# EAGLE design sequint (EAGLE 6.1)

## Sheet 1 of 4
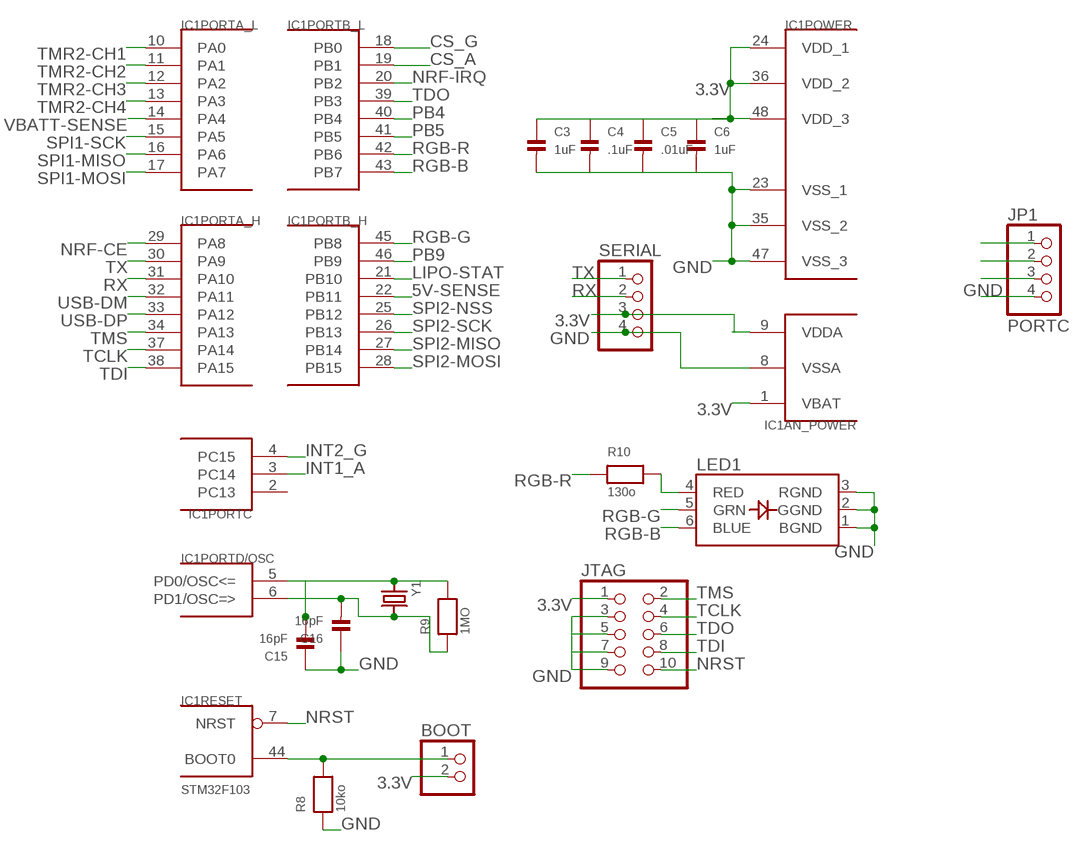
[diagram p0: schematic, sheet 1]

### Parts
BOOT  HEADER-1X2ROUND  [1X02_ROUND]
C3  1uF  CAP_CERAMIC0402  [0402]
C4  .1uF  CAP_CERAMIC0402  [0402]
C5  .01uF  CAP_CERAMIC0402  [0402]
C6  1uF  CAP_CERAMIC0402  [0402]
C15  16pF  CAP_CERAMIC0402  [0402]
C16  16pF  CAP_CERAMIC0402  [0402]
IC1  STM32F103  STM32F10XCXT6  [TQFP48]
JP1  PORTC  HEADER-1X4ROUND  [1X04_ROUND]
JTAG  HEADER-2X5  [2X05]
LED1  LED_RGB_PLCC6CREE-CLV6A  [RGBLED_PLCC6]
R8  10ko  RESISTOR0402  [0402]
R9  1MO  RESISTOR0402  [0402]
R10  130o  RESISTOR0402  [0402]
SERIAL  HEADER-1X4ROUND  [1X04_ROUND]
Y1  CRYSTALSMD  [HC49UP]

### Nets
3.3V: BOOT.2 C3.1 C4.1 C5.1 C6.1 IC1.1(AN_POWER:VBAT) IC1.9(AN_POWER:VDDA) IC1.24(POWER:VDD_1) IC1.36(POWER:VDD_2) IC1.48(POWER:VDD_3) JTAG.1 SERIAL.3 ; also sheet 2,3,4
5V-SENSE: IC1.22(PORTB_H:PB11) ; also sheet 3
BOOT0: BOOT.1 IC1.44(RESET:BOOT0) R8.2
CS_A: IC1.19(PORTB_L:PB1) ; also sheet 4
CS_G: IC1.18(PORTB_L:PB0) ; also sheet 4
GND: C3.2 C4.2 C5.2 C6.2 C15.1 C16.1 IC1.8(AN_POWER:VSSA) IC1.23(POWER:VSS_1) IC1.35(POWER:VSS_2) IC1.47(POWER:VSS_3) JP1.4 JTAG.3 JTAG.5 JTAG.7 JTAG.9 LED1.1(BGND) LED1.2(GGND) LED1.3(RGND) R8.1 SERIAL.4 ; also sheet 2,3,4
INT1_A: IC1.3(PORTC:PC14) ; also sheet 4
INT2_G: IC1.4(PORTC:PC15) ; also sheet 4
LIPO-STAT: IC1.21(PORTB_H:PB10) ; also sheet 3
NRF-CE: IC1.29(PORTA_H:PA8) ; also sheet 2
NRF-IRQ: IC1.20(PORTB_L:PB2) ; also sheet 2
NRST: IC1.7(RESET:NRST) JTAG.10
PB4: IC1.40(PORTB_L:PB4) JP1.1
PB5: IC1.41(PORTB_L:PB5) JP1.2
PB9: IC1.46(PORTB_H:PB9) JP1.3
PD0: C15.2 IC1.5(PORTD/OSC:PD0/OSC<=) R9.2 Y1.1
PD1: C16.2 IC1.6(PORTD/OSC:PD1/OSC=>) R9.1 Y1.2
RGB-B: IC1.43(PORTB_L:PB7) LED1.6(BLUE)
RGB-G: IC1.45(PORTB_H:PB8) LED1.5(GRN)
RGB-R: IC1.42(PORTB_L:PB6) R10.1
RGB-RP: LED1.4(RED) R10.2
RX: IC1.31(PORTA_H:PA10) SERIAL.2
SPI1-MISO: IC1.16(PORTA_L:PA6) ; also sheet 4
SPI1-MOSI: IC1.17(PORTA_L:PA7) ; also sheet 4
SPI1-SCK: IC1.15(PORTA_L:PA5) ; also sheet 4
SPI2-MISO: IC1.27(PORTB_H:PB14) ; also sheet 2
SPI2-MOSI: IC1.28(PORTB_H:PB15) ; also sheet 2
SPI2-NSS: IC1.25(PORTB_H:PB12) ; also sheet 2
SPI2-SCK: IC1.26(PORTB_H:PB13) ; also sheet 2
TCLK: IC1.37(PORTA_H:PA14) JTAG.4
TDI: IC1.38(PORTA_H:PA15) JTAG.8
TDO: IC1.39(PORTB_L:PB3) JTAG.6
TMR2-CH1: IC1.10(PORTA_L:PA0) ; also sheet 3
TMR2-CH2: IC1.11(PORTA_L:PA1) ; also sheet 3
TMR2-CH3: IC1.12(PORTA_L:PA2) ; also sheet 3
TMR2-CH4: IC1.13(PORTA_L:PA3) ; also sheet 3
TMS: IC1.34(PORTA_H:PA13) JTAG.2
TX: IC1.30(PORTA_H:PA9) SERIAL.1
USB-DM: IC1.32(PORTA_H:PA11) ; also sheet 3
USB-DP: IC1.33(PORTA_H:PA12) ; also sheet 3
VBATT-SENSE: IC1.14(PORTA_L:PA4) ; also sheet 3
Unconnected: IC1.2(PORTC:PC13)

## Sheet 2 of 4
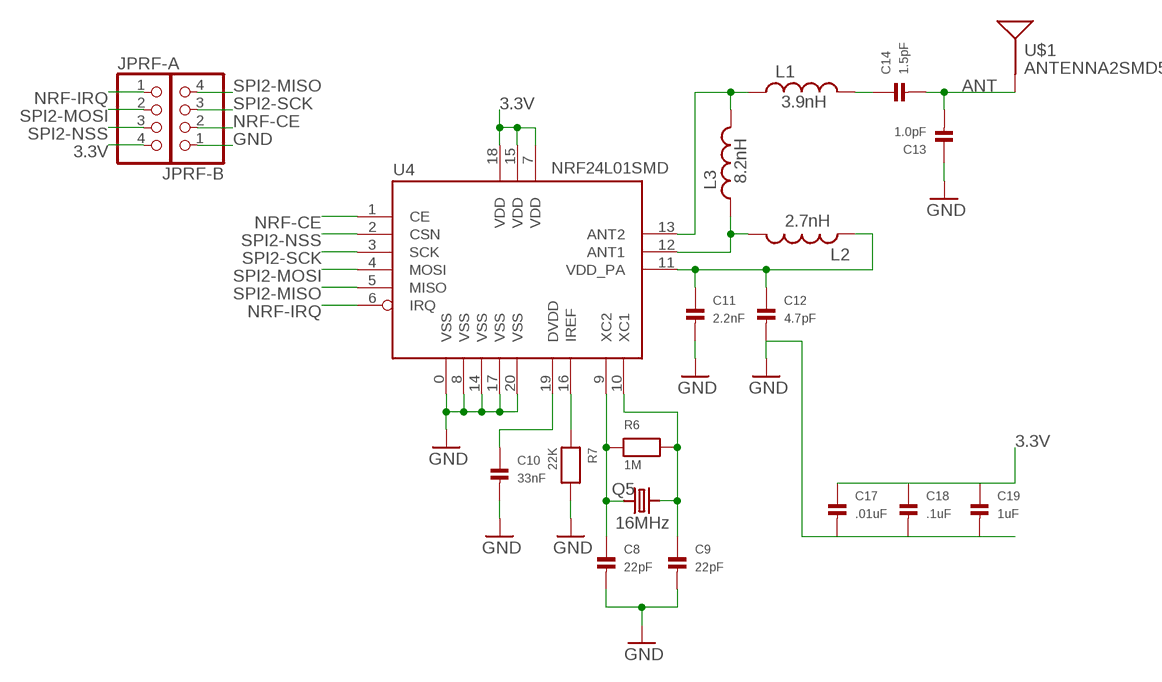
[diagram p1: schematic, sheet 2]

### Parts
C8  22pF  CAP_CERAMIC0402  [0402]
C9  22pF  CAP_CERAMIC0402  [0402]
C10  33nF  CAP_CERAMIC0402  [0402]
C11  2.2nF  CAP_CERAMIC0402  [0402]
C12  4.7pF  CAP_CERAMIC0402  [0402]
C13  1.0pF  CAP_CERAMIC0402  [0402]
C14  1.5pF  CAP_CERAMIC0402  [0402]
C17  .01uF  CAP_CERAMIC0402  [0402]
C18  .1uF  CAP_CERAMIC0402  [0402]
C19  1uF  CAP_CERAMIC0402  [0402]
JPRF-A  HEADER-1X4ROUND  [1X04_ROUND]
JPRF-B  HEADER-1X4ROUND  [1X04_ROUND]
L1  3.9nH  INDUCTOR0402  [C0402]
L2  2.7nH  INDUCTOR0402  [C0402]
L3  8.2nH  INDUCTOR0402  [C0402]
Q5  16MHz  CRYSTALSMD  [HC49UP]
R6  1M  RESISTOR0402  [0402]
R7  22K  RESISTOR0402  [0402]
U4  NRF24L01SMD  [QFN20]
U$1  ANTENNA2SMD5  [ANTENNA-CHIP5]

### Nets
3.3V: C17.1 C18.1 C19.1 JPRF-A.4 U4.7(VDD) U4.15(VDD) U4.18(VDD) ; also sheet 1,3,4
ANT: C13.2 C14.2 U$1.FEED(SIGNAL)
ANT1: L2.2 L3.1 U4.12(ANT1)
ANT2: L1.1 L3.2 U4.13(ANT2)
DVDD: C10.1 U4.19(DVDD)
GND: C8.2 C9.2 C10.2 C11.2 C12.2 C13.1 C17.2 C18.2 C19.2 JPRF-B.1 R7.2 U4.0(VSS) U4.8(VSS) U4.14(VSS) U4.17(VSS) U4.20(VSS) ; also sheet 1,3,4
N$2: C8.1 Q5.1 R6.1 U4.9(XC2)
N$3: C9.1 Q5.2 R6.2 U4.10(XC1)
N$5: R7.1 U4.16(IREF)
N$10: C14.1 L1.2
NRF-CE: JPRF-B.2 U4.1(CE) ; also sheet 1
NRF-IRQ: JPRF-A.1 U4.6(IRQ) ; also sheet 1
SPI2-MISO: JPRF-B.4 U4.5(MISO) ; also sheet 1
SPI2-MOSI: JPRF-A.2 U4.4(MOSI) ; also sheet 1
SPI2-NSS: JPRF-A.3 U4.2(CSN) ; also sheet 1
SPI2-SCK: JPRF-B.3 U4.3(SCK) ; also sheet 1
VDD_PA: C11.1 C12.1 L2.1 U4.11(VDD_PA)

## Sheet 3 of 4
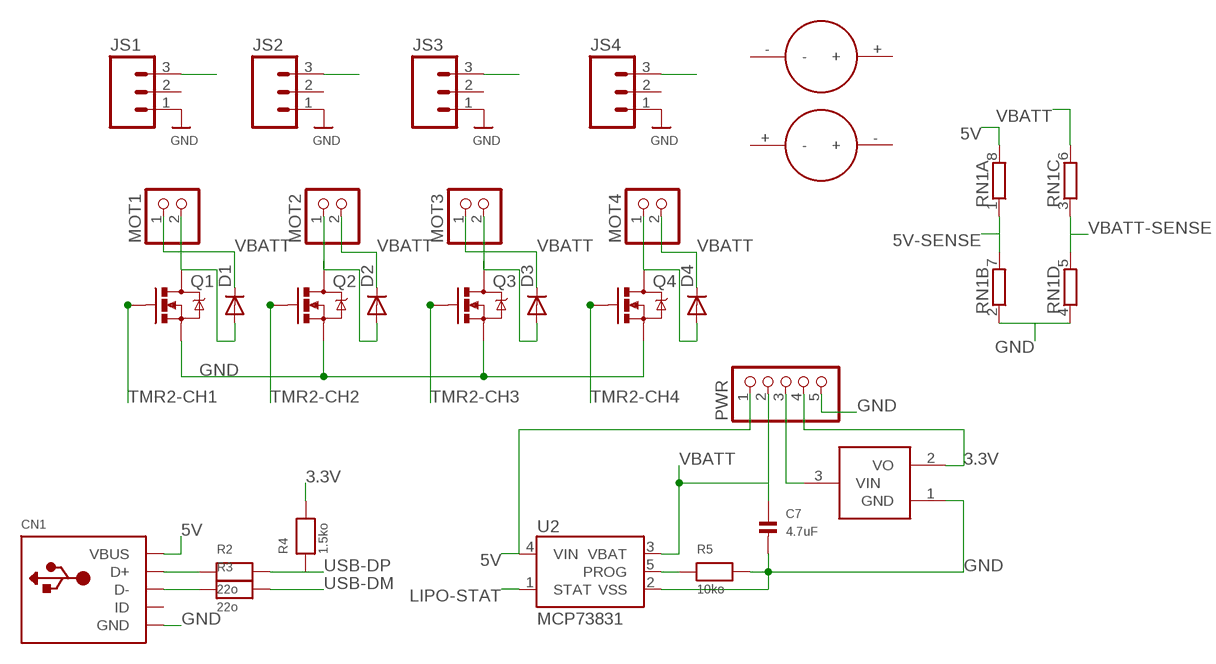
[diagram p2: schematic, sheet 3]

### Parts
3.3VREG  VREG  [SOT23-3]
C7  4.7uF  CAP_CERAMIC0603  [0603]
CN1  USBMINIB  [USB-MINIB]
D1  DIODESOD523  [SOD523]
D2  DIODESOD523  [SOD523]
D3  DIODESOD523  [SOD523]
D4  DIODESOD523  [SOD523]
JS1  M03LOCK  [1X03_LOCK]
JS2  M03LOCK  [1X03_LOCK]
JS3  M03LOCK  [1X03_LOCK]
JS4  M03LOCK  [1X03_LOCK]
MOT1  HEADER-1X2ROUND  [1X02_ROUND]
MOT2  HEADER-1X2ROUND  [1X02_ROUND]
MOT3  HEADER-1X2ROUND  [1X02_ROUND]
MOT4  HEADER-1X2ROUND  [1X02_ROUND]
PWR  HEADER-1X5ROUND  [1X05_ROUND]
Q1  MOSFET-N  MOSFET-NCHANNELSMD  [SOT23-3]
Q2  MOSFET-N  MOSFET-NCHANNELSMD  [SOT23-3]
Q3  MOSFET-N  MOSFET-NCHANNELSMD  [SOT23-3]
Q4  MOSFET-N  MOSFET-NCHANNELSMD  [SOT23-3]
R2  22o  RESISTOR0402  [0402]
R3  22o  RESISTOR0402  [0402]
R4  1.5ko  RESISTOR0402  [0402]
R5  10ko  RESISTOR0402  [0402]
RN1  RNETWORK  [RN8P-4R-CRA06S]
U2  MCP73831  [SOT23-5]
U$6  MOT_RICCW  [MOT_RIC_BM_CW]
U$7  MOT_RICCCW  [MOT_RIC_BM_CCW]

### Nets
3.3V: 3.3VREG.2(VO) PWR.4 R4.2 ; also sheet 1,2,4
5V: CN1.VBUS PWR.1 RN1.8 U2.4(VIN)
5V-SENSE: RN1.1 RN1.7 ; also sheet 1
GND: 3.3VREG.1(GND) C7.2 CN1.GND JS1.1 JS2.1 JS3.1 JS4.1 PWR.5 Q1.2(S) Q2.2(S) Q3.2(S) Q4.2(S) R5.2 RN1.2 RN1.4 U2.2(VSS) ; also sheet 1,2,4
LIPO-STAT: U2.1(STAT) ; also sheet 1
PROG: R5.1 U2.5(PROG)
TMR2-CH1: JS1.3 Q1.1(G) ; also sheet 1
TMR2-CH2: JS2.3 Q2.1(G) ; also sheet 1
TMR2-CH3: JS3.3 Q3.1(G) ; also sheet 1
TMR2-CH4: JS4.3 Q4.1(G) ; also sheet 1
USB+: CN1.D+ R2.1
USB-: CN1.D- R3.1
USB-DM: R3.2 ; also sheet 1
USB-DP: R2.2 R4.1 ; also sheet 1
VBATT: C7.1 D1.C D2.C D3.C D4.C MOT1.1 MOT2.2 MOT3.1 MOT4.2 PWR.2 RN1.6 U2.3(VBAT)
VBATT-SENSE: RN1.3 RN1.5 ; also sheet 1
VIN_3.3V: 3.3VREG.3(VIN) PWR.3
VL-1: D1.A MOT1.2 Q1.3(D)
VL-2: D2.A MOT2.1 Q2.3(D)
VL-3: D3.A MOT3.2 Q3.3(D)
VL-4: D4.A MOT4.1 Q4.3(D)
Unconnected: CN1.ID JS1.2 JS2.2 JS3.2 JS4.2 U$6.+ U$6.- U$7.+(-) U$7.-(+)

## Sheet 4 of 4
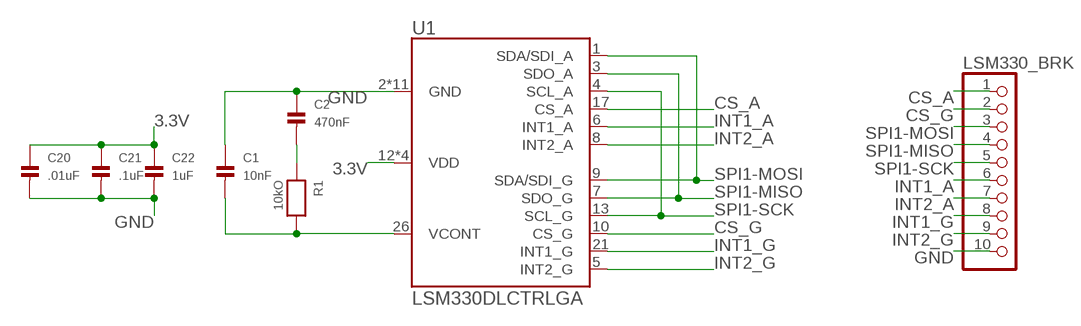
[diagram p3: schematic, sheet 4]

### Parts
C1  10nF  CAP_CERAMIC0402  [0402]
C2  470nF  CAP_CERAMIC0402  [0402]
C20  .01uF  CAP_CERAMIC0402  [0402]
C21  .1uF  CAP_CERAMIC0402  [0402]
C22  1uF  CAP_CERAMIC0402  [0402]
LSM330_BRK  HEADER-1X10ROUND  [1X10_ROUND]
R1  10kO  RESISTOR0402  [0402]
U1  LSM330DLCTRLGA  [LGA28L]

### Nets
3.3V: C20.1 C21.1 C22.1 U1.12(VDD) U1.15(VDD) U1.22(VDD) U1.28(VDD) ; also sheet 1,2,3
CS_A: LSM330_BRK.1 U1.17(CS_A) ; also sheet 1
CS_G: LSM330_BRK.2 U1.10(CS_G) ; also sheet 1
GND: C1.1 C2.1 C20.2 C21.2 C22.2 LSM330_BRK.10 U1.2(GND) U1.11(GND) U1.14(GND) U1.16(GND) U1.18(GND) U1.19(GND) U1.20(GND) U1.23(GND) U1.24(GND) U1.25(GND) U1.27(GND) ; also sheet 1,2,3
INT1_A: LSM330_BRK.6 U1.6(INT1_A) ; also sheet 1
INT1_G: LSM330_BRK.8 U1.21(INT1_G)
INT2_A: LSM330_BRK.7 U1.8(INT2_A)
INT2_G: LSM330_BRK.9 U1.5(INT2_G) ; also sheet 1
SPI1-MISO: LSM330_BRK.4 U1.3(SDO_A) U1.7(SDO_G) ; also sheet 1
SPI1-MOSI: LSM330_BRK.3 U1.1(SDA/SDI_A) U1.9(SDA/SDI_G) ; also sheet 1
SPI1-SCK: LSM330_BRK.5 U1.4(SCL_A) U1.13(SCL_G) ; also sheet 1
VCONT: C1.2 R1.2 U1.26(VCONT)
VCONT_1: C2.2 R1.1

## Library data of the parts
3.3VREG = nonolith:VREG
BOOT MOT1-MOT4 = nonolith:HEADER-1X2: PIN HEADER
C1-C22 = nonolith:CAP_CERAMIC: Ceramic Capacitors 0402 - 0402 Surface Mount Capacitors 0.1uF 10V 10% [Digikey: 490-1318-2-ND] 0603 - 0603 Surface Mount Capacitors 16 pF 50V 5% [Digikey: 445-5051-2-ND] 22 pF 50V [Digikey: PCC220ACVTR-ND] 33 pF 50V 5% [Digikey: 490-1415-1-ND] 56pF 50V 5% [Digikey: 490-1421-1-ND] 220pF 50V 5% [Digikey: 445-1285-1-ND] 680 pF 50V 2200 pF 50V 5% C0G [Digikey: 445-1297-1-ND] 5600 pF 100V 5% X7R [Digikey: 478-3711-1-ND] 0.1 µF 25V 10% [Digikey: PCC2277TR-ND] 0.22 µF 16V 10% X7R [Digikey: 445-1318-1-ND] 1.0 µF 25V 10% [Digikey: 445-5146-2-ND] 0603 - RF Specific 3pF 250V +/-0.1pF RF [Digikey: 712-1347-1-ND] 18 pF 250V 5% [Digikey: 478-3505-1-ND or 712-1322-1-ND] 56 pF 250V 5% C0G RF [Digikey: 490-4867-1-ND] 68 pF 250V RF [Digikey: 490-4868-1-ND] 0805 - 0805 Surface Mount Capacitors 220 pF 250V 2% RF Ceramic Capacitor [Digikey: 712-1398-1-ND] 1000 pF 50V 2% NP0 Ceramic Capacitor [Digikey: 478-3760-1-ND] 0.1 µF 25V 10% Ceramic Capacitor [Digikey: PCC1828TR-ND] 1.0 µF 16V 10% Ceramic Capacitor[Digikey: 490-1691-2-ND] 10.0 µF 10V 10% Ceramic Capacitor[Digikey: 709-1228-1-ND] 1206 - 1206 Surface Mount Capacitors
CN1 = nonolith:USB: USB Connectors USBMINIB - Surface Mount Female Mini-B USB Connector 4UConnector: 06564 By microbuilder.eu
D1-D4 = SparkFun-DiscreteSemi:DIODE: Diode These are standard reverse protection diodes and small signal diodes. SMA package can handle up to about 1A. SOD-323 can handle about 200mA. What the SOD-323 package when ordering, there are some mfgs out there that are 5-pin packages.
IC1 = stm32:STM32F10XCXT6: ST STM32F101/103 48pin LQFP
JP1 JPRF-A JPRF-B SERIAL = nonolith:HEADER-1X4: PIN HEADER
JS1-JS4 = SparkFun:M03: Header 3 Standard 3-pin 0.1" header. Use with straight break away headers (SKU : PRT-00116), right angle break away headers (PRT-00553), swiss pins (PRT-00743), machine pins (PRT-00117), and female headers (PRT-00115). Molex polarized connector foot print use with SKU : PRT-08232 with associated crimp pins and housings.
JTAG = nonolith:HEADER-2X5: PIN HEADER
L1-L3 = SparkFun:INDUCTOR: Inductors Basic Inductor/Choke - 0603 and 1206. Footprints are not proven and vary greatly between part numbers.
LED1 = microbuilder:LED_RGB_PLCC6: RGB LED Cree CLV6A-FKB - Digikey: CLV6A-FKB-CK1P1G1BB7R3R3TR-ND DC Foreward Current: 20mA Foreward Voltage: R = 2.0, G = 3.2, B = 3.2 Viewing Angle: 120°
LSM330_BRK = nonolith:HEADER-1X10: PIN HEADER
PWR = nonolith:HEADER-1X5: PIN HEADER
Q1-Q4 = SparkFun:MOSFET-NCHANNEL
Q5 Y1 = nonolith:CRYSTAL: Crystals HC49UP - Surface Mount Crystal 4.0MHz 18pF +/-30ppm Surface Mount Crystal [Digikey: 535-9857-1-ND] 12.0 MHz Surface Mount Crystal [Digikey: 535-9869-6-ND] 25.0 MHz Surface Mount Crystal [Digikey: 535-9078-1-ND] 3.2 x 2.5mm - MEMs SMT Crystal 12.0 MHz 8pF 15ppm 3.2 x 2.5mm Crystal [Digikey: 644-1047-1-ND] 16.0 MHz 8pF 15ppm 3.2 x 2.5mm Crystal [Digikey: 644-1049-1-ND] 16.0 MHz 10pF 10ppm 3.2 x 2.5mm Crystal [Digikey: 644-1100-1-ND] 27.12 MHz 18pF 30ppm 3.2 x 2.5mm Crystal [Digikey: 887-1424-1-ND] 4.9 x 1.8mm - MEMs SMT Crystal 32.768 KHz 12.5pF 20ppm 4.9 x 1.8mm Crystal [Digikey: SE2415CT-ND] Cylinder 32.768KHz Cylinder Crystal
R1-R10 = nonolith:RESISTOR: Resistors 0402 - 0402 Surface Mount Package 10.0K 1% 1/16W [Digikey: 311-10.0KLRTR-ND] 0603 - 0603 Surface Mount Package 0 Ohm 1/10 Watt 1% Resistor 15 Ohm 1/10 Watt 1% Resistor 33 Ohm 1/10 Watt 1% Resistor 49.9 Ohm 1/10 Watt 1% Resistor 100 Ohm 1/10 Watt 1% Resistor 150 Ohm 1/10 Watt 1% Resistor 240 Ohm 1/10 Watt 1% Resistor 390 Ohm 1/10 Watt 1% Resistor 560 Ohm 1/10 Watt 1% Resistor 750 Ohm 1/10 Watt 1% Resistor 1.0K Ohm 1/10 Watt 1% Resistor 1.5K Ohm 1/10 Watt 1% Resistor 2.0K Ohm 1/10 Watt 1% Resistor 4.7K Ohm 1/10 Watt 1% Resistor 10.0K Ohm 1/10 Watt 1% Resistor 20.0K Ohm 1/10 Watt 1% Resistor 33.0K Ohm 1/10 Watt 1% Resistor 100.0K Ohm 1/10 Watt 1% Resistor 0805 - 0805 Surface Mount Package 0 Ohm 1/8 Watt 1% Resistor 33 Ohm 1/8 Watt 1% Resistor 100 Ohm 1/8 Watt 1% Resistor 150 Ohm 1/8 Watt 1% Resistor 200 Ohm 1/8 Watt 1% Resistor 240 Ohm 1/8 Watt 1% Resistor 330 Ohm 1/8 Watt 1% Resistor 390 Ohm 1/8 Watt 1% Resistor 470 Ohm 1/8 Watt 1% Resistor 1.0K Ohm 1/8 Watt 1% Resistor 1.5K Ohm 1/8 Watt 1% Resistor 2.0K Ohm 1/8 Watt 1% Resistor 4.7K Ohm 1/8 Watt 1% Resistor 5.1K Ohm 1/8 Watt 1% Resistor 5.6K Ohm 1/8 Watt 1% Resistor 10.0K Ohm 1/8 Watt 1% Resistor 22.0K Ohm 1/8 Watt 1% Resistor 33.0K Ohm 1/8 Watt 1% Resistor 100K Ohm 1/8 Watt 1% Resistor 1206 - 1206 Surface Mount Package
RN1 = nonolith:RNETWORK: 4 Resistor Array 0603
U1 = nonolith:LSM330DLCTR: I2C/SPI accelerometer/gyroscope
U2 = SparkFun:MCP73831: Microchip's MCP73831 Miniature single cell, fully integrated Li-Ion, Li-polymer charge management controller http://ww1.microchip.com/downloads/en/DeviceDoc/21984a.pdf
U4 = SparkFun:NRF24L01: 2.4GHz Low Power Transceiver This is the very popular, low cost, very low power RF transceiver from Nordic Semiconductor. Simple SPI interface. SKU: COM-00690
U$1 = SparkFun-RF:ANTENNA2: Chip antenna Single endded antenna. Common with smaller chip antennas. CHIP4 package is the GPS Chip Antenna SKU: GPS-08418. CHIP5 package is 2.4GHz chip antenna SKU: WRL-00144.
U$6 U$7 = nonolith:MOT_RIC

## Net classes
0 default: width 0.203 mm, clearance 0.178 mm

## Board
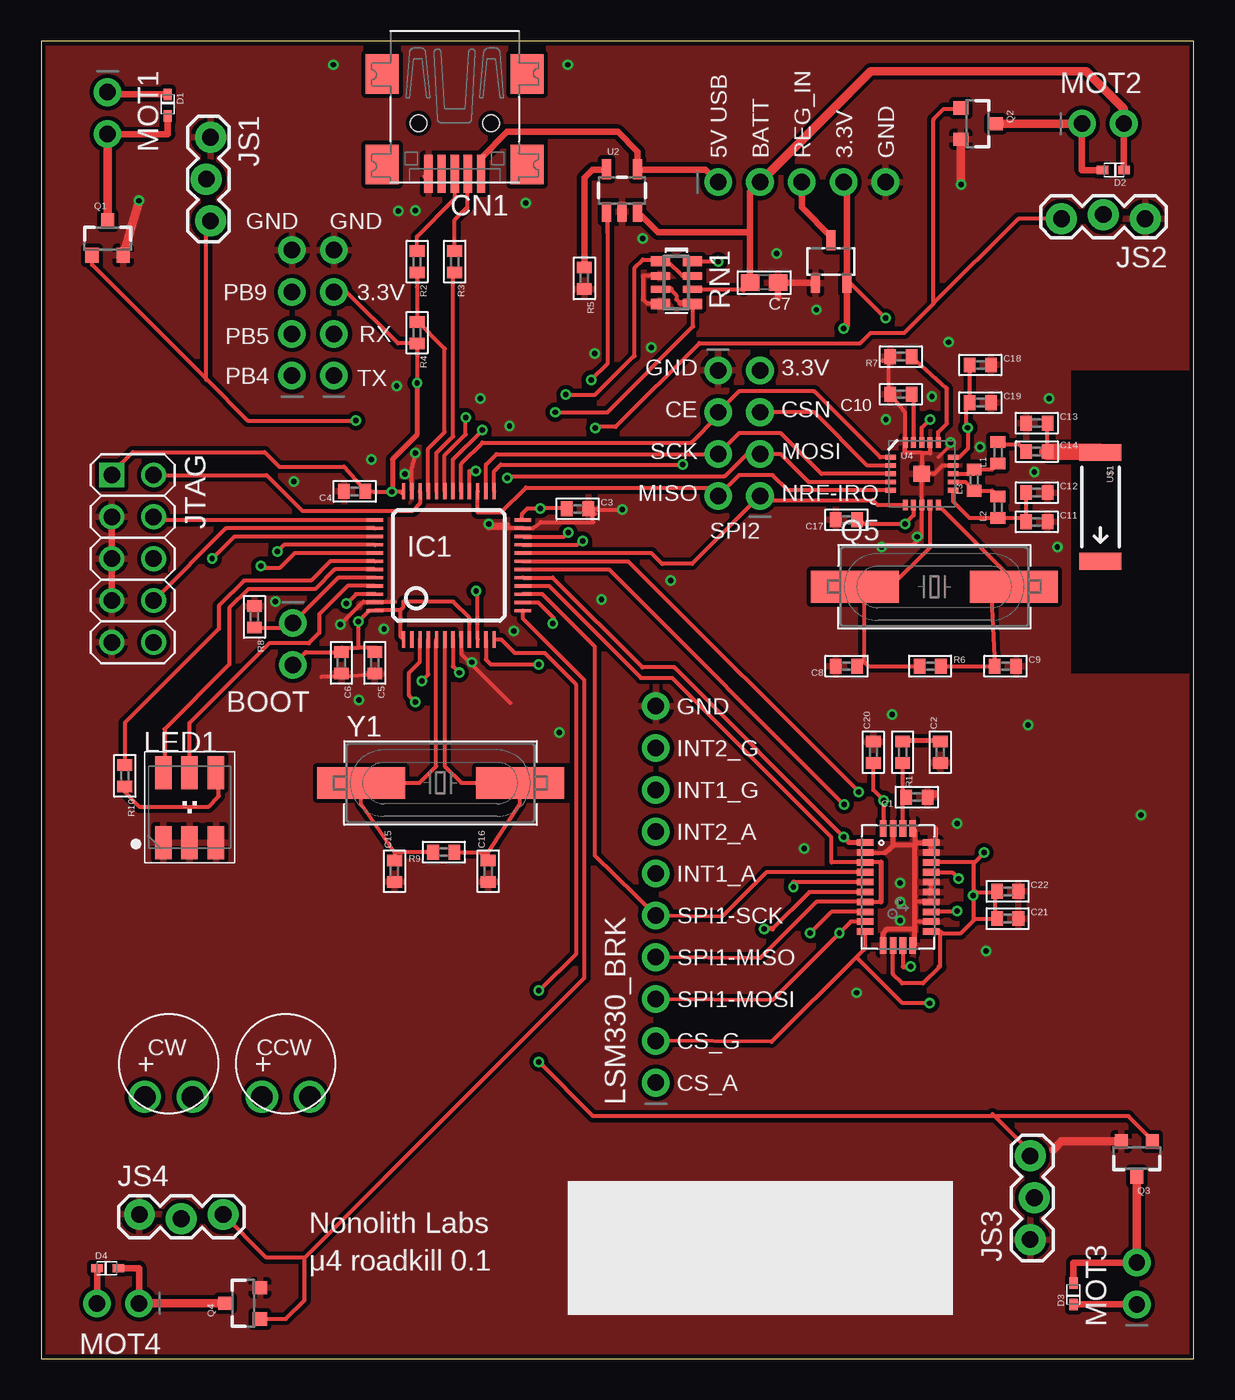
[diagram p4: board, top side]
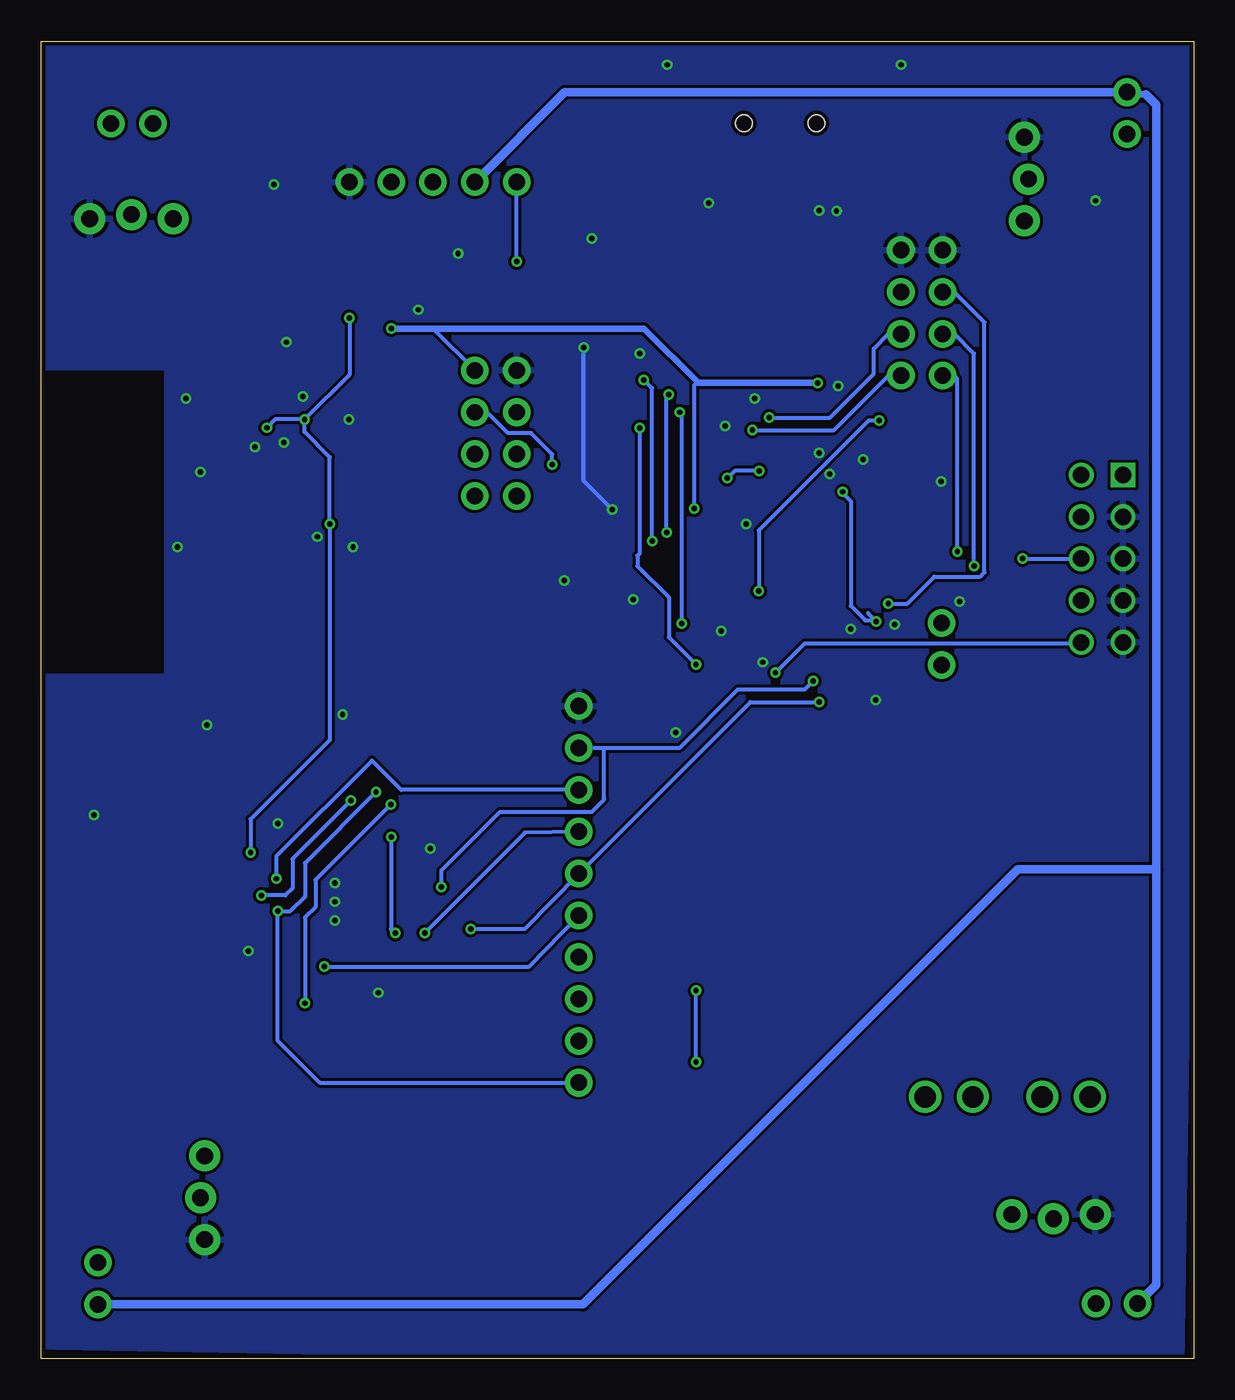
[diagram p5: board, bottom side, seen from below]

Size 70 x 80 mm. Coordinates in mm from the lower left corner, seen from the top.
Outline: 0,0 70,0 70,80 0,80 0,0
Copper layers (1*16): Top 0.035mm / dielectric 1.5mm / Bottom 0.035mm
Design rules: minimum track width 6mil, minimum drill 12mil, track to track 6mil, track to pad 6mil, pad to pad 6mil, via to via 6mil, smd to smd 0mil, copper to edge 10mil, drill to drill 10mil, minimum pad ring 10mil, minimum via ring 6mil, stop-mask expansion 2mil, vias tented up to drill 100mil, thermal gap 10mil

### Footprints (pad centres in the part's own frame; a part is rotated, then mirrored left to right if it is on the bottom)
SOT23-3 = smd 0.55 x 1.2: 1 0.95,1.3; 2 -0.95,1.3; 3 0,-1.3
1X02_ROUND = drill 1 pad 1.676: 1 -1.27,0; 2 1.27,0
0402 = smd 0.7 x 0.9: 1 -0.65,0; 2 0.65,0
0603 = smd 1.1 x 1: 1 -0.85,0; 2 0.85,0
USB-MINIB = smd 0.5 x 2.308: D+ 0,4.064; D- -0.8,4.064; GND 1.6,4.064; ID 0.8,4.064; VBUS -1.6,4.064 | smd 2 x 2.4: GND1 -4.4,-2; GND2 -4.4,3.5; GND3 4.4,3.5; GND4 4.4,-2 | hole 1: -2.2,1; 2.2,1
SOD523 = smd 0.7 x 0.5: A 0.7,0; C -0.6,0
TQFP48 = smd 0.2 x 1: 1 -2.75,-4.5; 2 -2.25,-4.5; 3 -1.75,-4.5; 4 -1.25,-4.5; 5 -0.75,-4.5; 6 -0.25,-4.5; 7 0.25,-4.5; 8 0.75,-4.5; 9 1.25,-4.5; 10 1.75,-4.5; 11 2.25,-4.5; 12 2.75,-4.5; 25 2.75,4.5; 26 2.25,4.5; 27 1.75,4.5; 28 1.25,4.5; 29 0.75,4.5; 30 0.25,4.5; 31 -0.25,4.5; 32 -0.75,4.5; 33 -1.25,4.5; 34 -1.75,4.5; 35 -2.25,4.5; 36 -2.75,4.5 | smd 1 x 0.2: 13 4.5,-2.75; 14 4.5,-2.25; 15 4.5,-1.75; 16 4.5,-1.25; 17 4.5,-0.75; 18 4.5,-0.25; 19 4.5,0.25; 20 4.5,0.75; 21 4.5,1.25; 22 4.5,1.75; 23 4.5,2.25; 24 4.5,2.75; 37 -4.5,2.75; 38 -4.5,2.25; 39 -4.5,1.75; 40 -4.5,1.25; 41 -4.5,0.75; 42 -4.5,0.25; 43 -4.5,-0.25; 44 -4.5,-0.75; 45 -4.5,-1.25; 46 -4.5,-1.75; 47 -4.5,-2.25; 48 -4.5,-2.75
1X04_ROUND = drill 1 pad 1.676: 1 -3.81,0; 2 -1.27,0; 3 1.27,0; 4 3.81,0
1X03_LOCK = drill 1.016 pad 1.88: 1 0,0.127; 2 2.54,-0.127; 3 5.08,0.127
2X05 = drill 1 square: 1 -5.08,-1.27 | drill 1: 2 -5.08,1.27; 3 -2.54,-1.27; 4 -2.54,1.27; 5 0,-1.27; 6 0,1.27; 7 2.54,-1.27; 8 2.54,1.27; 9 5.08,-1.27; 10 5.08,1.27
C0402 = smd 0.7 x 0.9: 1 -0.65,0; 2 0.65,0
RGBLED_PLCC6 = smd 1 x 2: 1 -1.6,-2.158; 2 0,-2.158; 3 1.6,-2.158; 4 1.6,2.108; 5 0,2.108; 6 -1.6,2.108
1X10_ROUND = drill 1 pad 1.676: 1 -11.43,0; 2 -8.89,0; 3 -6.35,0; 4 -3.81,0; 5 -1.27,0; 6 1.27,0; 7 3.81,0; 8 6.35,0; 9 8.89,0; 10 11.43,0
1X05_ROUND = drill 1 pad 1.676: 1 -5.08,0; 2 -2.54,0; 3 0,0; 4 2.54,0; 5 5.08,0
SOT23-3' = smd 0.8 x 0.9: 1 -0.95,-1; 2 0.95,-1; 3 0,1.1
HC49UP = smd 5.334 x 1.93: 1 -4.826,0; 2 4.826,0
RN8P-4R-CRA06S = smd 0.63 x 1.15: 1 -1.295,-0.975; 4 1.295,-0.975; 5 1.295,0.975; 8 -1.295,0.975 | smd 0.44 x 1.15: 2 -0.4,-0.975; 3 0.4,-0.975; 6 0.4,0.975; 7 -0.4,0.975
LGA28L = smd 0.4 x 1: 1 2.7,2; 2 2.1,2; 3 1.5,2; 4 0.9,2; 5 0.3,2; 6 -0.3,2; 7 -0.9,2; 8 -1.5,2; 9 -2.1,2; 10 -2.7,2; 15 -2.7,-2; 16 -2.1,-2; 17 -1.5,-2; 18 -0.9,-2; 19 -0.3,-2; 20 0.3,-2; 21 0.9,-2; 22 1.5,-2; 23 2.1,-2; 24 2.7,-2 | smd 1 x 0.4: 11 -3.55,0.9; 12 -3.55,0.3; 13 -3.55,-0.3; 14 -3.55,-0.9; 25 3.55,-0.9; 26 3.55,-0.3; 27 3.55,0.3; 28 3.55,0.9
SOT23-5 = smd 0.55 x 1.2: 1 -0.95,-1.3; 2 0,-1.3; 3 0.95,-1.3; 4 0.95,1.3; 5 -0.95,1.3
QFN20 = smd 1 x 1: 0 0,0 | smd 0.65 x 0.3: 1 -1.9,1; 2 -1.9,0.5; 3 -1.9,0; 4 -1.9,-0.5; 5 -1.9,-1; 11 1.9,-1; 12 1.9,-0.5; 13 1.9,0; 14 1.9,0.5; 15 1.9,1 | smd 0.3 x 0.65: 6 -1,-1.9; 7 -0.5,-1.9; 8 0,-1.9; 9 0.5,-1.9; 10 1,-1.9; 16 1,1.9; 17 0.5,1.9; 18 0,1.9; 19 -0.5,1.9; 20 -1,1.9
ANTENNA-CHIP5 = smd 1.016 x 2.54: FEED -3.302,0; NC 3.302,0
MOT_RIC_BM_CW = drill 1.3: + -1.45,-2; - 1.45,-2
MOT_RIC_BM_CCW = drill 1.3: + -1.45,-2; - 1.45,-2

### Placement (x,y rotation side)
3.3VREG  47.98,66.61 180 top
BOOT  15.3,43.41 270 top
C1  53.19,34.1 180 top
C2  54.61,36.83 90 top
C3  32.59,51.6 0 top
C4  19.05,52.67 180 top
C5  20.27,42.26 270 top
C6  18.23,42.26 270 top
C7  43.91,65.34 0 top
C8  48.92,42.05 180 top
C9  58.57,42.05 0 top
C10  52.22,58.56 180 top
C11  60.47,50.82 0 top
C12  60.47,52.59 0 top
C13  60.47,56.81 0 top
C14  60.47,55.08 0 top
C15  21.46,29.6 90 top
C16  27.15,29.6 90 top
C17  48.92,50.94 180 top
C18  57.05,60.34 0 top
C19  57.05,58.05 0 top
C20  50.55,36.83 90 top
C21  58.7,26.73 0 top
C22  58.7,28.38 0 top
CN1  25.12,76.01 180 top
D1  7.68,76.17 270 top
D2  65.17,72.17 180 top
D3  62.7,3.9 90 top
D4  4,5.5 0 top
IC1  24.76,48.17 0 top
JP1  15.24,63.5 90 top
JPRF-A  43.66,56.2 90 top
JPRF-B  41.12,56.2 270 top
JS1  10.16,74.17 270 top
JS2  67.06,69.34 180 top
JS3  60.2,7.24 90 top
JS4  5.97,8.64 0 top
JTAG  5.56,48.58 270 top
L1  58.11,55.01 90 top
L2  58.11,51.7 90 top
L3  56.66,53.36 90 top
LED1  9.02,33.49 0 top
LSM330_BRK  37.34,28.19 90 top
MOT1  4.04,75.63 270 top
MOT2  64.49,75 0 top
MOT3  66.55,4.57 90 top
MOT4  4.67,3.37 180 top
PWR  46.2,71.44 0 top
Q1  MOSFET-N  [SOT23-3']  4.04,68.01 0 top
Q2  MOSFET-N  [SOT23-3']  56.87,75 270 top
Q3  MOSFET-N  [SOT23-3']  66.55,12.19 180 top
Q4  MOSFET-N  [SOT23-3']  12.29,3.37 90 top
Q5  54.25,46.88 0 top
R1  52.32,36.83 270 top
R2  22.83,66.61 270 top
R3  25.12,66.61 270 top
R4  22.83,62.3 270 top
R5  32.99,65.6 270 top
R6  54,42.05 0 top
R7  52.22,60.85 180 top
R8  12.96,45.04 270 top
R9  24.45,30.76 180 top
R10  5.08,35.39 270 top
RN1  38.58,65.34 270 top
SERIAL  17.78,63.5 90 top
U1  52.04,28.64 90 top
U2  35.28,70.93 0 top
U4  53.49,53.74 0 top
U$1  64.34,51.73 270 top
U$6  7.75,17.91 0 top
U$7  14.86,17.91 0 top
Y1  24.25,34.97 0 top

### Tracks (layer width: path | path; a pad name or v marks a point on that pad's centre or on a via)
3.3V  (via drill 0.33)
  Top 0.254: 54.58,23.82 54.58,25.94 U1.15 | 54.55,23.78 53.57,22.8 52.3,22.8 51.74,23.35 U1.12 | 54.04,30.16 56.61,30.16 v56.61,28.13 | U4.18 53.49,56.53 v54,57.04 | U4.15 55.76,54.74 56.28,55.26 v56.28,56.53 56.2,56.62 56.2,57.85 C19.1 C18.1 | v56.61,28.13 56.61,26.61 | 54.68,25.85 55.85,25.85 56.61,26.61 | U4.7 52.99,51.2 v52.47,50.69 50.02,50.69 C17.1 | JTAG.1 4.29,53.79 5.56,55.06 13.56,55.06 14.45,54.17 18.4,54.17 C4.1 20.13,52.64 v21.31,52.64 21.34,52.67 IC1.36 21.92,52.58 | 48.99,65.34 49.12,65.34 v51.28,63.19 | v22.83,59.25 R4.2 21.67,61.65 18.54,64.77 SERIAL.3 | C3.1 31.71,51.63 v30.32,51.63 29.53,51.63 29.21,51.31 29.21,50.92 IC1.24 | 19.3,43.18 18.29,43.18 18.35,43.12 18.25,43.12 C6.1 16.07,42.91 BOOT.2 | 19.3,43.18 20.32,43.18 20.32,43.16 C5.1 | 19.3,43.18 19.28,43.21 v19.28,44.77 19.93,45.42 IC1.48 20.3,45.47 21.84,45.47 | IC1.9 26.01,44.98 25.02,45.97 22.01,45.97 22.01,45.63 21.84,45.47 | IC1.1 21.84,43.84 21.84,45.47 | U1.28 51.18,32.23 v51.18,33.91 50.55,34.54 C20.1 | v56.61,28.13 56.8,28.32 | 56.8,28.32 58.04,28.32 | 58.04,28.32 58.17,28.32 57.91,28.07 57.91,26.67 | 56.61,26.61 56.74,26.73 C21.1 | 56.8,28.32 56.64,28.48 56.64,30.1 v57.28,30.73 57.3,30.73 | C22.1 58.04,28.32 | 58.04,28.32 58.17,28.19 58.17,28.45
  Top 0.305: 54.58,23.82 54.55,23.82 54.55,23.78 | U1.28 | U1.22 54.04,30.16 | 3.3VREG.2 48.93,65.34 48.99,65.34 | 54.58,25.94 54.68,25.85 | v22.83,59.25 22.83,56.11 21.34,54.61 21.34,52.67 v21.31,52.64
  Top 0.406: PWR.4 48.93,71.25 3.3VREG.2 48.93,62.74 v48.74,62.55 | v21.31,52.64 21.31,52.52
  Bottom 0.254: v54,57.04 55.78,57.04 v56.28,56.53 | v54,57.04 54,56.28 52.47,54.75 v52.47,50.69 52.47,37.57 57.28,32.77 v57.28,30.73 | 19.78,45.28 v19.28,44.77 19.34,44.83 19.94,44.83 20.83,45.72 20.83,52.07 21.34,52.58 | v51.28,63.19 51.28,59.76 v54,57.04 | v48.74,62.55 46.2,62.55 JPRF-A.4 | v30.32,51.63 30.32,59.12 30.2,59.25 30.07,59.25 | v51.18,33.91 54.74,30.35 54.74,28.57 55.18,28.13 v56.61,28.13 | 21.34,52.7 21.34,52.58 | 21.34,52.58 21.31,52.61 v21.31,52.64
  Bottom 0.406: v48.74,62.55 33.37,62.55 30.07,59.25 v22.83,59.25 | 43.53,59.88 JPRF-A.4
5V  (via drill 0.33)
  Top 0.254: RN1.8 41.09,66.64 v41.12,66.61
  Top 0.406: PWR.1 40.36,72.2 36.29,72.2 36.26,72.23 U2.4 36.23,73.28 35.02,74.49 28.29,74.49 26.77,72.96 26.77,72 CN1.VBUS 26.72,70.98
  Bottom 0.254: v41.12,66.61 PWR.1
5V-SENSE  (via drill 0.33)
  Top 0.254: RN1.7 38.94,65.74 38.07,66.61 37.63,66.61 | RN1.1 37.5,66.74 36.55,66.74 36.04,66.23 36.04,60.9 35.97,60.83 35.94,60.83 33.66,58.55 v31.88,58.55 | IC1.22 31.76,49.92 v32,50.16
  Top 0.406: 37.63,66.61 RN1.1
  Bottom 0.254: v32,50.16 32,58.42 v31.88,58.55
ANT
  Top 0.254: C14.2 C13.2 | 64.29,55.08 U$1.FEED
  Top 1.016: C14.2 64.29,55.08
ANT1
  Top 0.254: U4.12 56.13,53.24 L3.1 57.76,52.7 L2.2
ANT2
  Top 0.254: U4.13 56.66,53.74 L3.2 57.76,54.01 L1.1
BOOT0
  Top 0.254: IC1.44 18.05,47.42 BOOT.1 15.02,44.39 R8.2
CS_A  (via drill 0.33)
  Top 0.254: U1.17 54.08,27.18 v55.63,27.18 | IC1.19 35.65,48.42 v49.66,34.42
  Bottom 0.254: LSM330_BRK.1 53.09,16.76 55.63,19.3 v55.63,27.18 54.86,27.18 53.98,28.07 53.98,30.1 v49.66,34.42
CS_G  (via drill 0.33)
  Top 0.254: U1.10 50.04,24.9 49.53,24.38 | 49.53,24.38 44.36,19.24 LSM330_BRK.2 | IC1.18 34.5,47.92 v48.77,33.66 | v53.98,21.59 52.32,21.59 49.53,24.38
  Bottom 0.254: v48.77,33.66 53.34,29.08 53.34,27.43 53.98,26.8 v53.98,21.59
DVDD
  Top 0.254: C10.1 53.07,58.4 52.98,58.31 U4.19
GND  (via drill 0.33)
  Top 0.203: 55.12,55.37 54.48,54.74
  Top 0.254: 37.58,64.07 36.8,64.07 36.55,64.33 36.55,65.74 RN1.2 | U1.16 53.06,26.54 | U4.0 U4.8 53.49,49.93 52.98,49.42 51.2,49.42 51.12,49.51 | 54.76,54.24 U4.14 54.77,54.24 54.76,54.24 | 53.99,55.25 U4.17 54,55.63 54,54.97 53.96,55.01 53.49,55.01 | 53.49,55.01 52.49,55.01 52.48,54.99 52.48,55.62 U4.20 | 52.49,55.24 U4.20 | 53.49,55.01 U4.0 | 51.46,58.47 C10.2 | C10.2 51.46,58.65 51.46,60.85 R7.2 51.12,60.59 | 54.76,54.24 54.25,53.74 U4.0 | U4.20 52.49,57.44 C10.2 | IC1.35 22.51,54.1 v22.73,54.99 | IC1.8 25.51,42.81 28.51,39.82 | C5.2 18.29,41.41 18.29,41.4 18.24,41.4 | C6.2 18.24,41.4 | 18.24,41.4 17.02,41.4 | v35.31,51.56 33.78,51.56 33.74,51.6 C3.2 33.65,51.31 33.53,51.31 33.53,50.8 30.35,50.8 29.85,50.42 IC1.23 27.18,50.42 v27.18,50.67 28.32,50.67 28.32,50.42 29.34,50.42 | U1.2 51.28,30.74 | U1.20 U1.19 | U1.18 53.06,27.74 53.06,27.8 | 19.56,45.97 v18.16,44.58 | 21.48,45.95 19.58,45.95 19.56,45.97 | 19.56,45.97 20.21,45.97 IC1.47
  Top 0.305: 51.74,31.18 U1.27 | 51.28,30.74 51.53,30.93 51.74,31.14 51.74,31.18 | 53.06,25.09 U1.14 53.06,25.09 | 53.06,25.09 53.06,26.1 | 53.06,26.1 53.06,26.54 53.06,27.8 53.06,31.18 | U1.11 51.14,25.85 51.4,26.1 53.06,26.1 | U1.24 U1.23 | U1.25 53.06,32.08 53.06,31.18 | 53.06,31.18 51.74,31.18 | 53.06,31.18 53.22,31.34 U1.24 | U1.24 54.07,31.37 54.07,31.43 54.33,31.43 54.33,32.2 | C2.1 54.42,35.92 54.33,36.01 | 54.33,34.4 C1.1 54.33,34.23
  Top 0.406: 37.58,64.07 RN1.4 | 35.28,69.66 U2.2 | 3.3VREG.1 47,65.34 C7.2 44.76,64.42 | JTAG.3 JTAG.5 JTAG.7 | CN1.GND 23.34,71.77
  Top 0.508: Q1.2 v5.95,70.31 | Q2.2 v55.87,71.31 | 61.47,12.7 61.98,13.21 65.58,13.21 Q3.2
  Bottom 0.254: v35.31,51.56 37.06,53.31 v37.06,61.41
  other vias: 15.34,53.28 36.55,68.01 47.09,63.69 44.68,67.12 31.47,38.04 61.21,58.29 61.72,49.28 51.05,49.28 51.31,57.02 55.24,55.63 54.1,58.42 57.02,55.37 60.33,53.85 53.21,49.91 26.16,42.29 34.04,46.1 26.67,58.29 19.3,40.01 21.7,69.68 17.76,78.57 31.98,78.57 29.44,70.19 33.63,61.04 38.23,47.24 51.69,39.12 46.35,30.99 49.53,22.23 57.4,24.77 55.63,32.51 52.17,26.61 52.17,27.75 52.17,28.89 14.22,45.97 59.94,38.48 21.59,59.05 20.83,44.32 28.7,44.2 66.8,33.02 55.12,61.72 20.07,54.61 28.45,56.64 22.73,69.72 22.1,53.72
  pour Top (isolate 0.254): -0.25,0.25 69.82,0.25 70.87,41.15 70.87,41.4 62.36,41.4 62.36,60.2 70.61,60.2 70.36,80.08 69.82,80.08 -0.76,80.33
  pour Bottom: 0.76,-0.51 70.84,0.76 70.87,41.4 62.36,41.4 62.36,60.2 70.61,60.2 70.61,80.84 70.58,80.84 -0.51,80.33
INT1_A  (via drill 0.33)
  Top 0.254: 44.42,26.1 46.66,28.34 U1.6 | v22.73,39.88 22.35,40.26 22.35,41.66 23.01,42.32 IC1.3
  Top 0.305: 44.42,26.1 v43.91,26.1
  Bottom 0.254: v43.91,26.1 40.61,26.1 LSM330_BRK.6 26.92,39.88 v22.73,39.88
INT1_G  (via drill 0.33)
  Top 0.254: U1.21 55.33,29.54 v55.73,29.15
  Bottom 0.254: LSM330_BRK.8 48.13,34.54 49.91,36.32 55.73,30.51 v55.73,29.15
INT2_A  (via drill 0.33)
  Top 0.254: v46.71,25.85 48,27.14 U1.8
  Bottom 0.254: LSM330_BRK.7 40.61,31.94 v46.71,25.85
INT2_G  (via drill 0.33)
  Top 0.254: U1.5 45.69,28.94 | v23.11,41.15 23.51,41.55 IC1.4
  Top 0.305: 45.69,28.94 v45.69,28.64
  Bottom 0.254: v45.69,28.64 45.69,29.66 42.14,33.21 36.55,33.21 35.79,33.98 35.81,34 35.81,37.08 | 35.81,37.08 31.24,37.08 27.69,40.64 23.62,40.64 v23.11,41.15 | 35.81,37.08 37.08,37.08 37.15,37.02 LSM330_BRK.9
LIPO-STAT  (via drill 0.33)
  Top 0.254: 34.39,68.39 34.39,69.57 | 34.39,69.57 U2.1 | IC1.21 32.53,49.42 v32.89,49.66 | v33.4,59.44 34.42,60.45 34.42,69.54 34.39,69.57
  Bottom 0.254: v32.89,49.66 32.89,58.93 v33.4,59.44
N$2
  Top 0.254: U4.9 53.99,51.71 | 53.99,51.71 54,51.7 | 53.99,51.71 53.99,49.26 51.53,46.8 50.01,46.8 | 50.01,46.8 49.5,46.8 Q5.1 | C8.1 50.01,42.29 | 50.01,42.29 50.01,46.8 | 50.01,42.29 50.25,42.05 R6.1
N$3
  Top 0.254: U4.10 59.08,47.25 Q5.2 58.49,46.29 57.63,46.29 57.72,46.2 C9.1 R6.2
N$5
  Top 0.254: U4.16 54.49,56.26 55.01,56.78 55.01,58.9 R7.1
N$10
  Top 0.254: L1.2 58.49,55.53 59.38,55.53 C14.1
NRF-CE
  Top 0.254: U4.1 50.97,54.74 46.96,58.74 42.39,58.74 JPRF-B.2 | 41.12,57.34 JPRF-B.2 | IC1.29 25.51,54.34 26.8,55.63 39.5,55.63 41.12,57.25 JPRF-B.2
NRF-IRQ
  Top 0.254: U4.6 50.82,51.84 50.52,52.14 44.17,52.14 43.91,52.39 JPRF-A.1 39.53,48.26 37.72,48.26 37.05,48.92 IC1.20
NRST  (via drill 0.33)
  Top 0.254: IC1.7 25.01,42.04 v25.4,41.66
  Bottom 0.254: v25.4,41.66 23.62,43.43 6.83,43.43 JTAG.10
PB4  (via drill 0.33)
  Top 0.254: IC1.40 14.75,49.42 v14.35,49.02
  Bottom 0.254: v14.35,49.02 14.35,59.5 14.54,59.69 JP1.1
PB5  (via drill 0.33)
  Top 0.254: IC1.41 15.4,48.92 14.48,48.01 13.46,48.01 v13.34,48.13
  Bottom 0.254: v13.34,48.13 13.34,61.03 14.54,62.23 JP1.2
PB9  (via drill 0.33)
  Top 0.254: IC1.46 19.12,46.42 v18.54,45.85
  Bottom 0.254: v18.54,45.85 17.4,45.85 15.75,47.5 12.95,47.5 12.7,47.75 12.7,62.93 14.54,64.77 JP1.3
PD0
  Top 0.254: IC1.5 24,35.98 22.98,34.97 Y1.1 19.43,33.7 21.46,30.76 | R9.2 21.46,30.76 | 21.46,30.76 C15.2
PD1
  Top 0.254: IC1.6 24.51,43.35 24.51,35.98 25.52,34.97 Y1.2 29.08,33.7 27.15,30.76 | R9.1 27.15,30.76 | C16.2 27.15,30.76
PROG
  Top 0.406: R5.1 32.99,71.69 33.5,72.2 34.26,72.2 34.26,72.17 U2.5
RGB-B
  Top 0.254: LED1.6 7.49,35.67 7.49,38.23 11.43,42.16 11.43,45.59 12.57,46.74 16.64,46.74 17.82,47.92 IC1.43
RGB-G
  Top 0.254: IC1.45 18.6,46.92 16.89,45.21 16.89,44.07 16.26,43.43 13.84,43.43 9.02,38.61 LED1.5
RGB-R
  Top 0.254: 5.02,36.13 5.08,36.2 5.08,38.61 10.79,44.32 10.79,45.72 12.32,47.24 16.38,47.24 17.56,48.42 IC1.42 | 5.02,36.13 4.95,36.07 | R10.1 5.08,36.06 5.02,36.13
RGB-RP
  Top 0.254: R10.2 5.08,34.41 5.97,33.53 10.16,33.53 10.79,34.16 10.79,35.42 LED1.4
RX  (via drill 0.33)
  Top 0.254: IC1.31 24.51,54.87 25.78,56.13 v25.78,57.15
  Bottom 0.254: v25.78,57.15 22.1,57.15 19.43,59.82 19.43,61.34 18.54,62.23 SERIAL.2
SPI1-MISO
  Top 0.254: LSM330_BRK.4 43.66,24.32 47.08,27.74 U1.7 51.03,27.74 | IC1.16 30.83,46.93 36.42,41.34 38.33,41.34 47.98,31.69 47.98,30.16 48,30.14 U1.3 | 50.04,30.16 51.03,30.16
  Top 0.305: 51.03,27.74 51.03,30.16 | 50.01,30.16 50.04,30.16 U1.3
SPI1-MOSI  (via drill 0.33)
  Top 0.254: LSM330_BRK.3 44.42,21.78 v48.49,25.85 49.18,26.54 U1.9 | v48.74,31.69 38.45,41.98 36.52,41.98 31.07,47.42 IC1.17
  Top 0.305: U1.1 49.09,31.34 v48.74,31.69
  Bottom 0.254: v48.74,31.69 48.74,26.1
  Bottom 0.305: 48.74,26.1 v48.49,25.85
SPI1-SCK  (via drill 0.33)
  Top 0.254: U1.13 52.34,23.82 | IC1.15 30.45,46.42 33.63,43.25 33.63,30.55 LSM330_BRK.5 41.37,26.86 44.05,29.54 U1.4
  Top 0.305: 52.34,23.82 v52.8,23.82
  Bottom 0.254: v52.8,23.82 40.36,23.82 LSM330_BRK.5
SPI2-MISO
  Top 0.254: U4.5 51.47,52.74 | 51.47,52.74 51.46,52.72 | 51.47,52.74 45.35,52.74 44.42,53.66 42.39,53.66 JPRF-B.4 40.61,52.9 29.44,52.9 27.91,51.37 26.52,51.37 IC1.27
SPI2-MOSI  (via drill 0.33)
  Top 0.254: 51.58,53.23 U4.4 51.47,53.24 51.46,53.23 46.63,53.23 44.93,54.93 JPRF-A.2 43.6,54.99 42.93,54.99 41.53,53.59 28.45,53.59 v28.32,53.47 | IC1.28 26.01,53.91 v26.39,53.91
  Bottom 0.254: v26.39,53.91 27.87,53.91 v28.32,53.47
SPI2-NSS  (via drill 0.33)
  Top 0.254: U4.2 50.2,54.24 46.96,57.47 JPRF-A.3 43.53,57.6 43.02,57.6 | IC1.25 27.51,53.9 27.91,54.3 v38.96,54.3
  Bottom 0.254: v38.96,54.3 38.96,54.93 40.23,56.2 41.63,56.2 43.02,57.6 43.53,57.6 JPRF-A.3
SPI2-SCK
  Top 0.254: U4.3 47.39,53.74 44.93,56.2 42.39,56.2 JPRF-B.3 27.66,54.93 27.01,54.28 IC1.26
TCLK
  Top 0.254: IC1.37 7.03,50.92 JTAG.4
TDI
  Top 0.254: IC1.38 11.21,50.42 JTAG.8
TDO  (via drill 0.33)
  Top 0.254: IC1.39 11.73,49.92 v10.39,48.58
  Bottom 0.254: v10.39,48.58 JTAG.6
TMR2-CH1  (via drill 0.33)
  Top 0.254: 3.02,67 3.07,67 Q1.1 3.09,66.42 10.07,59.44 | 10.07,59.44 10.03,59.44 10.03,68.83 JS1.3 | 10.07,59.44 12.54,56.96 v19.11,56.96 | IC1.10 26.51,46.51 v26.42,46.61
  Bottom 0.254: v26.42,46.61 26.42,50.29 19.75,56.96 v19.11,56.96
TMR2-CH2  (via drill 0.33)
  Top 0.254: 54.2,64.07 54.12,63.99 52.42,62.3 50.39,62.3 49.76,61.66 39.98,61.66 34.9,56.58 33.72,56.58 v33.66,56.52 | 54.2,64.07 54.2,75.25 54.84,75.89 55.85,75.89 55.87,75.87 | Q2.1 55.87,75.87 | 55.87,75.87 55.98,75.76 | IC1.11 27.01,42.46 27.3,42.16 v30.23,42.16 | JS2.3 59.34,69.22 54.2,64.07
  Top 0.305: 55.8,76.01 Q2.1
  Bottom 0.254: v33.66,56.52 33.66,48.9 33.78,48.77 33.78,48.13 31.88,46.23 31.88,43.81 v30.23,42.16
TMR2-CH3  (via drill 0.33)
  Top 0.254: IC1.12 27.93,43.67 27.94,43.69 28.76,42.87 30.58,42.87 32.48,40.96 32.48,24.58 v30.23,22.35 | Q3.1 67.31,13.38 67.31,13.46 66.04,14.73 57.91,14.73 | 57.91,14.73 33.53,14.73 v30.23,18.03 | JS3.3 60.07,12.57 57.91,14.73 | 57.91,14.73 57.78,14.86
  Bottom 0.254: v30.23,18.03 v30.23,22.35
TMR2-CH4
  Top 0.254: Q4.1 14.86,2.42 16,3.56 16,6.14 | IC1.13 29.26,44.94 32.99,41.21 32.99,23.14 16,6.14 | 16,6.14 13.67,6.14 JS4.3
TMS
  Top 0.254: JTAG.2 13.69,53.66 15.85,51.5 22.58,51.5 23.01,51.94 IC1.34
TX  (via drill 0.33)
  Top 0.254: IC1.30 25.01,54.6 v26.8,56.39
  Bottom 0.254: v26.8,56.39 21.84,56.39 18.54,59.69 SERIAL.1
USB+
  Top 0.254: CN1.D+ 25.12,70.42 22.83,68.14 R2.1
USB-
  Top 0.254: CN1.D- 25.88,71.95 25.88,69.92 25.12,69.15 R3.1
USB-DM
  Top 0.254: IC1.32 24.01,55 25.02,56.01 25.02,65.66 25.15,65.79 25.14,65.79 R3.2
USB-DP
  Top 0.254: 22.83,65.85 R2.2 | R2.2 R4.1 22.8,63.12 22.73,63.12 24.51,61.34 24.51,56.26 23.51,55.26 IC1.33 | R2.2 22.83,65.09
VBATT
  Top 0.254: RN1.6 42.66,64.94
  Top 0.406: 42.66,64.94 C7.1 43.06,68.39 | PWR.2 43.06,70.84 43.06,68.39 | 65.76,75.89 MOT2.2 65.76,72.17 D2.C | U2.3 37.47,68.39 43.06,68.39 | D1.C 4.04,76.77 MOT1.1 | D4.C MOT4.2 | D3.C MOT3.1
  Top 0.508: 65.76,75.89 63.47,78.17 50.39,78.17 PWR.2
  Bottom 0.406: 2.89,76.77 4.67,76.77 4.54,76.9 MOT1.1
  Bottom 0.508: 4.54,76.9 38.2,76.9 PWR.2 | MOT4.2 2.26,4.51 2.26,29.72 | 2.26,29.72 2.26,76.14 2.89,76.77 | 2.26,29.72 10.67,29.72 37.08,3.3 MOT3.1
VBATT-SENSE  (via drill 0.33)
  Top 0.254: 38.22,64.94 38.58,64.58 38.58,64.33 38.83,64.07 | IC1.14 30.19,45.92 31.11,45 31.11,44.58 31.09,44.6 v31.09,44.64 | v31.21,57.47 34.39,57.47 39.6,62.68 39.6,64.01 RN1.5
  Top 0.305: 38.83,64.07 39.6,64.07
  Top 0.406: RN1.3 38.22,64.94 | 38.83,64.07 39.53,64.07 RN1.5
  Bottom 0.254: v31.09,44.64 31.09,57.34 v31.21,57.47
VCONT
  Top 0.254: U1.26 52.34,34.15 | 52.34,34.15 52.32,34.16 | R1.2 52.3,34.14 | 52.3,34.14 C1.2 | 52.3,34.14 52.34,34.14 52.34,34.15
VCONT_1
  Top 0.305: C2.2 54.58,37.53 52.3,37.53 R1.1
VDD_PA
  Top 0.254: U4.11 55.39,52.05 56.39,51.05 L2.1 59.59,51.05 C11.1 C12.1
VIN_3.3V
  Top 0.406: PWR.3 46.2,69.92 47.98,68.14 3.3VREG.3 47.98,67.88
VL-1
  Top 0.406: MOT1.2 7.68,74.36 D1.A
  Top 0.508: MOT1.2 Q1.3
VL-2
  Top 0.406: D2.A 63.22,72.17 MOT2.1
  Top 0.508: MOT2.1 Q2.3
VL-3
  Top 0.406: MOT3.2 62.7,5.84 D3.A
  Top 0.508: Q3.3 MOT3.2
VL-4
  Top 0.406: D4.A 5.94,5.5 MOT4.1
  Top 0.508: Q4.3 MOT4.1

### Text on the board
tPlace: Nonolith Labs | μ4 roadkill 0.1
tNames: 5V USB | BATT | REG_IN | 3.3V | GND | GND | GND | 3.3V | PB9 | RX | PB5 | TX | GND | 3.3V | PB4 | CE | CSN | SCK | MOSI | MISO | NRF-IRQ | SPI2 | GND | INT2_G | INT1_G | INT2_A | INT1_A | SPI1-SCK | SPI1-MISO | SPI1-MOSI | CS_G | CS_A